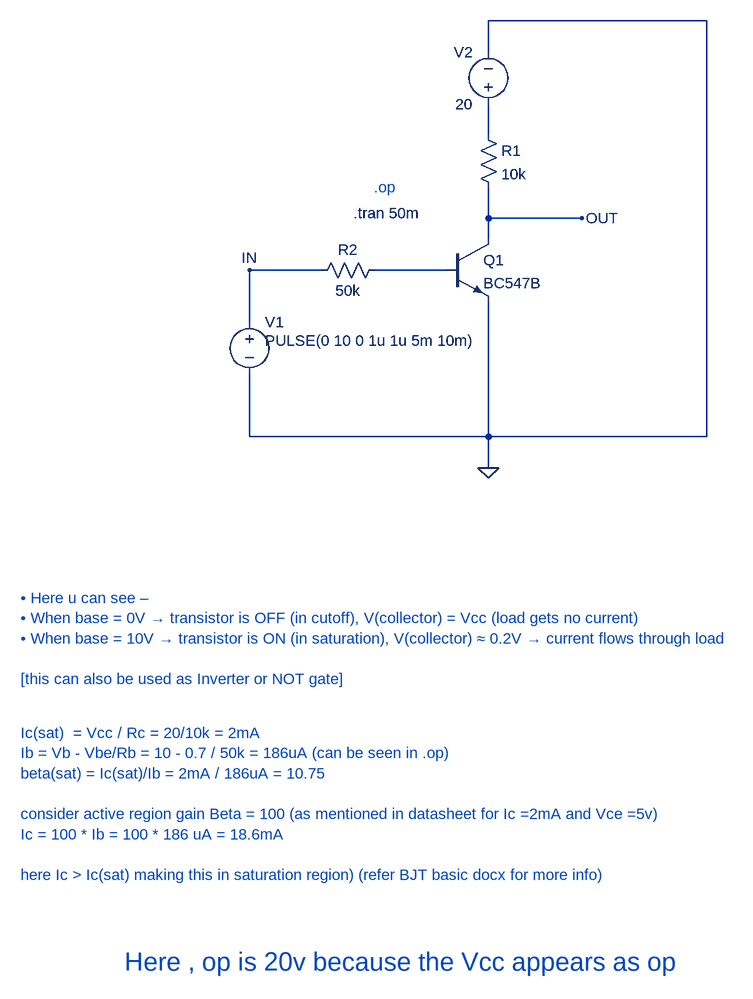
[diagram p0: schematic BJT_as_switch.asc]
BJT_as_switch.asc, the LTspice schematic file:
Version 4.1
SHEET 1 1664 1204
WIRE 688 -272 352 -272
WIRE 352 -224 352 -272
WIRE 352 -96 352 -144
WIRE 352 32 352 -16
WIRE 496 32 352 32
WIRE 352 64 352 32
WIRE 96 112 -16 112
WIRE 288 112 176 112
WIRE -16 192 -16 112
WIRE -16 368 -16 272
WIRE 352 368 352 160
WIRE 352 368 -16 368
WIRE 688 368 688 -272
WIRE 688 368 352 368
WIRE 352 416 352 368
FLAG 352 416 0
FLAG 496 32 OUT
FLAG -16 112 IN
SYMBOL voltage -16 176 R0
WINDOW 3 24 44 Left 2
WINDOW 123 0 0 Left 0
WINDOW 39 0 0 Left 0
SYMATTR Value PULSE(0 10 0 1u 1u 5m 10m)
SYMATTR InstName V1
SYMBOL npn 288 64 R0
SYMATTR InstName Q1
SYMATTR Value BC547B
SYMBOL voltage 352 -128 R180
WINDOW 0 24 96 Left 2
WINDOW 3 24 16 Left 2
WINDOW 123 0 0 Left 0
WINDOW 39 0 0 Left 0
SYMATTR InstName V2
SYMATTR Value 20
SYMBOL res 336 -112 R0
SYMATTR InstName R1
SYMATTR Value 10k
SYMBOL res 192 96 R90
WINDOW 0 0 56 VBottom 2
WINDOW 3 32 56 VTop 2
SYMATTR InstName R2
SYMATTR Value 50k
TEXT 144 24 Left 2 !.tran 50m
TEXT 176 -16 Left 2 ;.op
TEXT -368 616 Left 2 ;• Here u can see – \n• When base = 0V → transistor is OFF (in cutoff), V(collector) = Vcc (load gets no current)\n• When base = 10V → transistor is ON (in saturation), V(collector) ≈ 0.2V → current flows through load\n \n[this can also be used as Inverter or NOT gate]
TEXT -368 824 Left 2 ;Ic(sat)  = Vcc / Rc = 20/10k = 2mA\nIb = Vb - Vbe/Rb = 10 - 0.7 / 50k = 186uA (can be seen in .op)\nbeta(sat) = Ic(sat)/Ib = 2mA / 186uA = 10.75\n \nconsider active region gain Beta = 100 (as mentioned in datasheet for Ic =2mA and Vce =5v)\nIc = 100 * Ib = 100 * 186 uA = 18.6mA\n \nhere Ic > Ic(sat) making this in saturation region) (refer BJT basic docx for more info)
TEXT -208 1176 Left 4 ;Here , op is 20v because the Vcc appears as op

The netlist it stands for:
* BJT_as_switch.asc
V1 IN 0 PULSE(0 10 0 1u 1u 5m 10m)
Q1 OUT N002 0 0 BC547B
V2 N001 0 20
R1 N001 OUT 10k
R2 N002 IN 50k
.model NPN NPN
.model PNP PNP
.lib standard.bjt
.tran 50m
* .op
* • Here u can see –
* • When base = 0V → transistor is OFF (in cutoff), V(collector) = Vcc (load gets no current)
* • When base = 10V → transistor is ON (in saturation), V(collector) ≈ 0.2V → current flows through load
* [this can also be used as Inverter or NOT gate]
* Ic(sat)  = Vcc / Rc = 20/10k = 2mA
* Ib = Vb - Vbe/Rb = 10 - 0.7 / 50k = 186uA (can be seen in .op)
* beta(sat) = Ic(sat)/Ib = 2mA / 186uA = 10.75
* consider active region gain Beta = 100 (as mentioned in datasheet for Ic =2mA and Vce =5v)
* Ic = 100 * Ib = 100 * 186 uA = 18.6mA
* here Ic > Ic(sat) making this in saturation region) (refer BJT basic docx for more info)
* Here , op is 20v because the Vcc appears as op
.backanno
.end

* Results of the author's LTspice run, read from the files saved beside the schematic
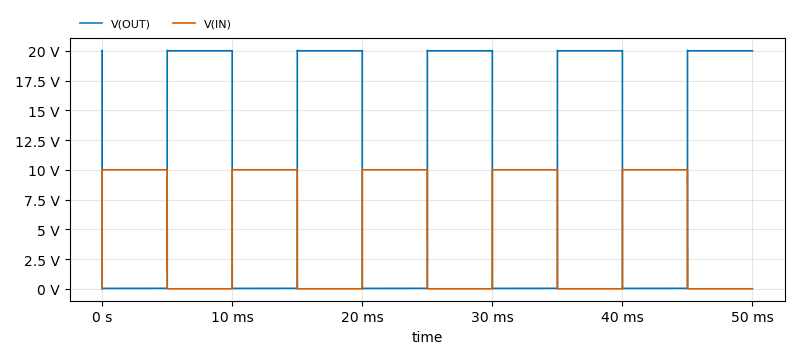
[diagram p1: Transient Analysis of BJT_as_switch.asc, plotted from the saved traces]
* Transient Analysis, 1 run:
*   V(OUT): min 33.74 mV, max 20.04 V, average 10.01 V, rms 14.14 V, last 20 V
*   V(IN): min 0 V, max 10 V, average 5.001 V, rms 7.072 V, last 0 V